# Altium project Glucometro_v2_project.PrjPCB
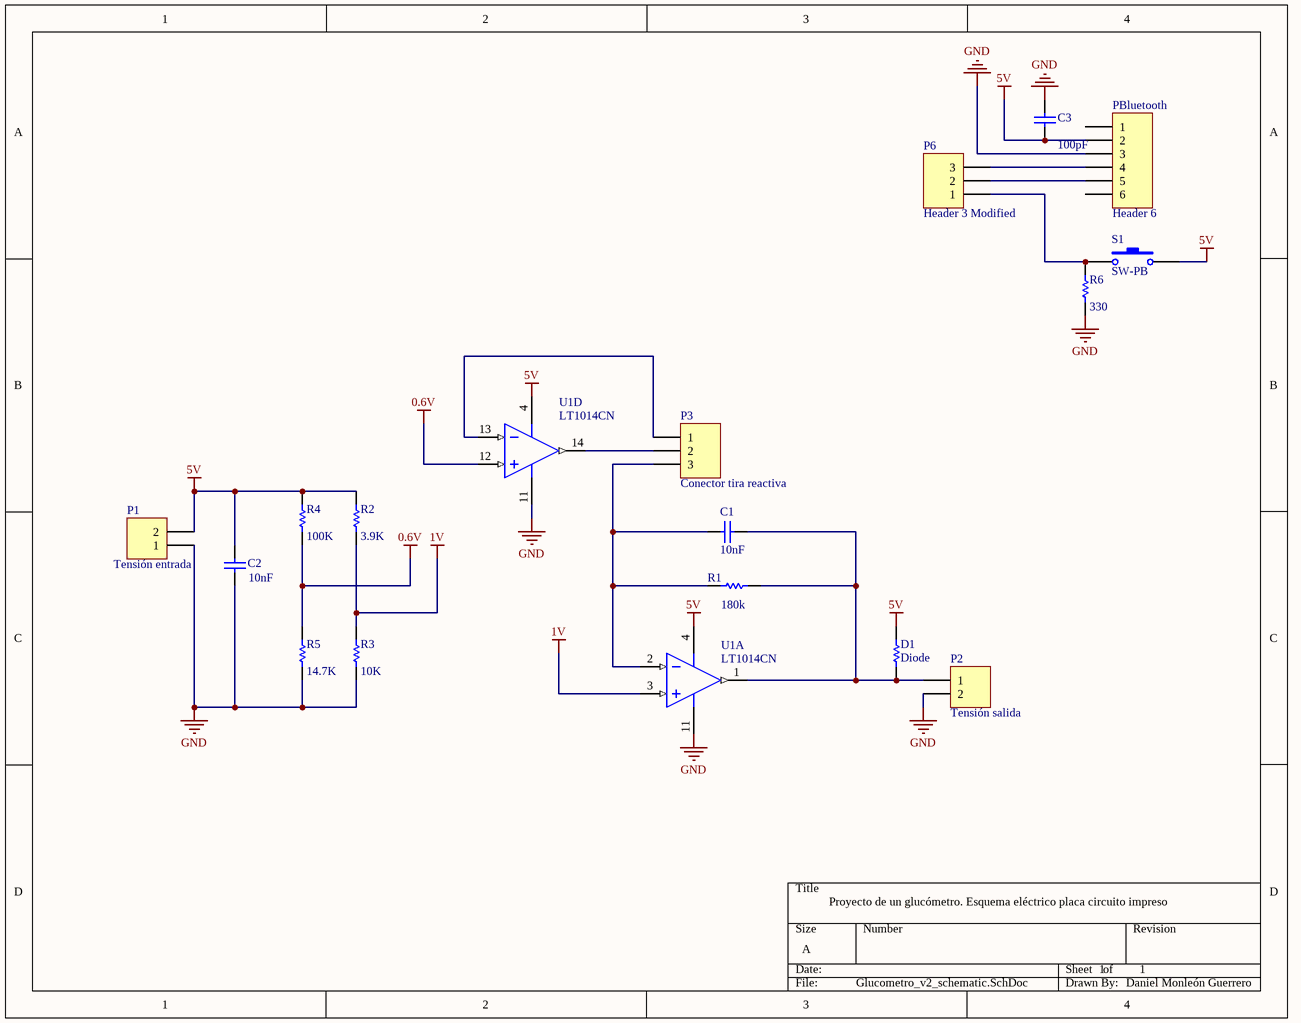
[diagram p0: Glucometro_v2_schematic.SchDoc]
1 sheet, 17 parts. Net scope: global (net labels, ports and power ports of the same name join across sheets).
Board file: Glucometro_v2_PCB.PcbDoc

## Sheet Glucometro_v2_schematic.SchDoc
size A

### Parts
C1  value 10nF  [CAP_EDITED]  (hidden comment: Cap Modified)
C2  value 10nF  [CAP_ALIM_EDITED]  (hidden comment: Cap)
C3  value 100pF  [CAP_ALIM_EDITED]  (hidden comment: Cap)
D1  Diode  [AXIAL-0.3]
P1  Tensión entrada  [Header2_edited]
P2  Tensión salida  [Header2_edited]
P3  Conector tira reactiva  [HEADER3_EDITED]
P6  Header 3 Modified  [HEADER3_EDITED]
PBluetooth  Header 6  [HEADERBLUETOOTH]
R1  value 180k  [AXIAL-0.3]  (hidden comment: Res1)
R2  value 3.9K  [AXIAL-0.3]  (hidden comment: Res1)
R3  value 10K  [AXIAL-0.3]  (hidden comment: Res1)
R4  value 100K  [AXIAL-0.3]  (hidden comment: Res1)
R5  value 14.7K  [AXIAL-0.3]  (hidden comment: Res1)
R6  value 330  [AXIAL-0.3]  (hidden comment: Res1)
S1  SW-PB  [BUTTON]
U1  LT1014CN  [LT-N-14]  (parts A,D of 4)

### Nets
0.6V: R4.1 R5.2 U1.12(+IN_D)
1V: R2.1 R3.2 U1.3(+IN_A)
5V: C2.2 C3.1 D1.2 P1.2 PBluetooth.2 R2.2 R4.2 S1.2 U1.4(V+)
GND: C2.1 C3.2 P1.1 P2.2 PBluetooth.3 R3.1 R5.1 R6.1 U1.11(V-)
NetC1_1: C1.1 P3.3 R1.1 U1.2(-IN_A)
NetC1_2: C1.2 D1.1 P2.1 R1.2 U1.1(OUTPUT_A)
NetP3_1: P3.1 U1.13(-IN_D)
NetP3_2: P3.2 U1.14(OUTPUT_D)
NetP6_1: P6.1 R6.2 S1.1
NetP6_2: P6.2 PBluetooth.5
NetP6_3: P6.3 PBluetooth.4

Not connected (* = marked no-connect by the designer): PBluetooth 1 6

### Notes on the sheet
- Proyecto de un glucómetro. Esquema eléctrico placa circuito impreso
- 1
- Daniel Monleón Guerrero

### Library data of the parts
C1-C3 = Cap: Capacitor; Published: 8-Jun-2000; LatestRevisionDate: 17-Jul-2002; LatestRevisionNote: Re-released for DXP Platform.; PackageReference: RAD-0.3; Publisher: Altium Limited; PackageDescription: Radial Cap, Thru-Hole; 2 Leads; 0.3 in Pin Spacing
D1 R1-R6 = Res1: Resistor; Published: 8-Jun-2000; LatestRevisionDate: 17-Jul-2002; LatestRevisionNote: Re-released for DXP Platform.; PackageReference: AXIAL-0.3; Publisher: Altium Limited; PackageDescription: Axial Device, Thru-Hole; 2 Leads; 0.3 in Pin Spacing
P1 P2 = Header 2: Header, 2-Pin; LatestRevisionDate: 17-Jul-2002; LatestRevisionNote: Re-released for DXP Platform.; Publisher: Altium Limited
P3 = Header 3: Header, 3-Pin; LatestRevisionDate: 17-Jul-2002; LatestRevisionNote: Re-released for DXP Platform.; Publisher: Altium Limited
P6 = Header 3: Header, 3-Pin; pin to pad: 2>3 3>2; LatestRevisionDate: 17-Jul-2002; LatestRevisionNote: Re-released for DXP Platform.; Publisher: Altium Limited
PBluetooth = Header 6: Header, 6-Pin; LatestRevisionDate: 17-Jul-2002; LatestRevisionNote: Re-released for DXP Platform.; Publisher: Altium Limited
S1 = Button: Switch; pin to pad: 1>2 2>3; Published: 24-Mar-1999; LatestRevisionDate: 17-Jul-2002; LatestRevisionNote: Re-released for DXP Platform.; PackageReference: SPST-2; Publisher: Altium Limited; PackageDescription: Switch; 2 Leads
U1 = LT1014CN: Quad Channel, Precision Single Supply Operational Amplifier, 0.8 MHz Typical GBW, 0.4 V/us Typical SR, 4 to 44 V, 14-Pin DIP (N-14), Commerical; Linear Technology Part Number: LT1014; Manufacturer: Linear Technology; Channels (#): 4; GBW (MHz) Typical: 0.8; Is (mA) Typical: 0.35; SR (V/us) Typical: 0.4; Vos (mV) Typical: 0.04; Vs Max (V): 44; DatasheetVersion: Rev. D; PackageVersion: Rev I; PackageReference: LT-N-14; PackageDescription: 14-Lead PDIP, Body 19.558 x 6.477 mm, Pitch 2.54 mm; Supplier 1: Digi-Key; Supplier Part Number 1: LT1014CNLT-ND; Supplier 2: Newark; Supplier Part Number 2: 57M0838; Type: VFB; Vs Min (V): 4; Mounting Technology: Through Hole; PartNumber: LT1014CN; ComponentLink1Description: Manufacturer URL; ComponentLink1URL: http://www.linear.com/; ComponentLink2Description: Datasheet; ComponentLink2URL: http://cds.linear.com/docs/en/datasheet/10134fd.pdf; ComponentLink3Description: Package Specification; ComponentLink3URL: http://cds.linear.com/docs/en/packaging/05081510_I_N14.pdf